# Altium schematic sheet ERN_MainPower.SchDoc
size A; SheetNumber: 1; SheetTotal: 2; SPICEModelCachePHLGHTKS: <root> / <DocumentId>PHLGHTKS</DocumentId> / </root>
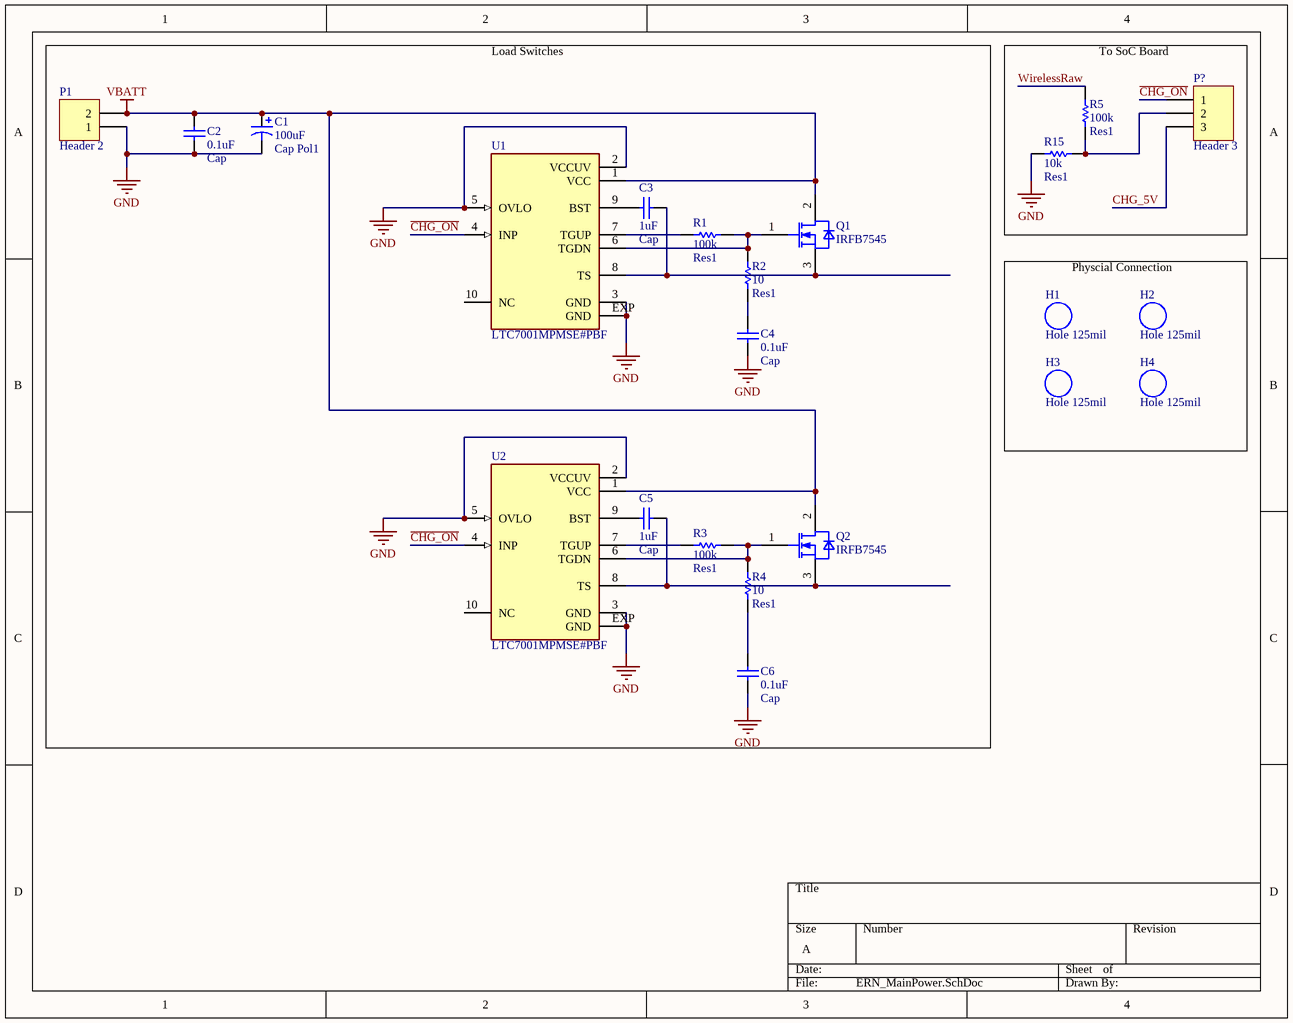
[diagram p0: ERN_MainPower.SchDoc]

## Parts
C1  Cap Pol1  value 100uF  [RB7.6-15]
C2  Cap  value 0.1uF  [RAD-0.3]
C3  Cap  value 1uF  [C0805]
C4  Cap  value 0.1uF  [C0805]
C5  Cap  value 1uF  [C0805]
C6  Cap  value 0.1uF  [C0805]
H1  Hole 125mil  [Hole 125mil]
H2  Hole 125mil  [Hole 125mil]
H3  Hole 125mil  [Hole 125mil]
H4  Hole 125mil  [Hole 125mil]
P1  Header 2  [HDR1X2]
P?  Header 3  [HDR1X3]
Q1  IRFB7545  [IFX-PG-TO220-3-904]
Q2  IRFB7545  [IFX-PG-TO220-3-904]
R1  Res1  value 100k  [AXIAL-0.3]
R2  Res1  value 10  [AXIAL-0.3]
R3  Res1  value 100k  [AXIAL-0.3]
R4  Res1  value 10  [AXIAL-0.3]
R5  Res1  value 100k  [AXIAL-0.3]
R15  Res1  value 10k  [AXIAL-0.3]
U1  LTC7001MPMSE#PBF  [SOP50P490X110-11N]
U2  LTC7001MPMSE#PBF  [SOP50P490X110-11N]

## Blocks framed on the sheet
Load Switches: C1-C6 P1 Q1 Q2 R1-R4 U1 U2
To SoC Board: P? R5 R15
Physcial Connection: H1-H4

## Nets
GND: C1.2 C2.1 C4.2 C6.2 P1.1 R15.2 U1.2(VCCUV) U1.3(GND) U1.5(OVLO) U1.EXP(GND) U2.2(VCCUV) U2.3(GND) U2.5(OVLO) U2.EXP(GND)
VBATT: C1.1 C2.2 P1.2 Q1.2(DRAIN) Q2.2(DRAIN) U1.1(VCC) U2.1(VCC)
~{CHG_ON}: P?.1 U1.4(INP) U2.4(INP)
CHG_5V: P?.3
WirelessRaw: R5.1
NetC3_1: C3.1 Q1.3(SOURCE) U1.8(TS)
NetC3_2: C3.2 U1.9(BST)
NetC4_1: C4.1 R2.2
NetC5_1: C5.1 Q2.3(SOURCE) U2.8(TS)
NetC5_2: C5.2 U2.9(BST)
NetC6_1: C6.1 R4.2
NetP?_2: P?.2 R5.2 R15.1
NetQ1_1: Q1.1(GATE) R1.1 R2.1 U1.6(TGDN)
NetQ2_1: Q2.1(GATE) R3.1 R4.1 U2.6(TGDN)
NetR1_2: R1.2 U1.7(TGUP)
NetR3_2: R3.2 U2.7(TGUP)

Not connected (* = marked no-connect by the designer): U1 10(NC); U2 10(NC)

## Library data of the parts
C1 = Cap Pol1: Polarized Capacitor (Radial); Published: 8-Jun-2000; LatestRevisionDate: 17-Jul-2002; LatestRevisionNote: Re-released for DXP Platform.; PackageReference: RB7.6-15; Publisher: Altium Limited; PackageDescription: Polarized Capacitor (Radial); 2 Leads
C2-C6 = Cap: Capacitor; Published: 8-Jun-2000; LatestRevisionDate: 17-Jul-2002; LatestRevisionNote: Re-released for DXP Platform.; PackageReference: RAD-0.3; Publisher: Altium Limited; PackageDescription: Radial Cap, Thru-Hole; 2 Leads; 0.3 in Pin Spacing
P1 = Header 2: Header, 2-Pin; LatestRevisionDate: 17-Jul-2002; LatestRevisionNote: Re-released for DXP Platform.; Publisher: Altium Limited
P? = Header 3: Header, 3-Pin; LatestRevisionDate: 17-Jul-2002; LatestRevisionNote: Re-released for DXP Platform.; Publisher: Altium Limited
Q1 Q2 = IRFB7545: N-Channel 60V 95A; Insulated-Gate Field-Effect Transistor (IGFET), N-Channel, Enhancement, Body Diode, Pin 1 Gate, 2 Drain, 3 Source, 3 Pins; Manufacturer: Infineon Technologies; Manufacturer Order Number: IRFB7545; PackageReference: PG-TO220-3-904
R1-R5 R15 = Res1: Resistor; Published: 8-Jun-2000; LatestRevisionDate: 17-Jul-2002; LatestRevisionNote: Re-released for DXP Platform.; PackageReference: AXIAL-0.3; Publisher: Altium Limited; PackageDescription: Axial Device, Thru-Hole; 2 Leads; 0.3 in Pin Spacing
U1 U2 = LTC7001MPMSE#PBF: Fast 150V High Side NMOS Static Switch Driver; MF: Analog Devices; SnapEDA_Link: https://www.snapeda.com/parts/LTC7001MPMSE%23PBF/Analog+Devices/view-part/?ref=snap; Package: MSOP -10 Analog Devices; Value: *; MP: LTC7001MPMSE#PBF; Check_prices: https://www.snapeda.com/parts/LTC7001MPMSE%23PBF/Analog+Devices/view-part/?ref=eda